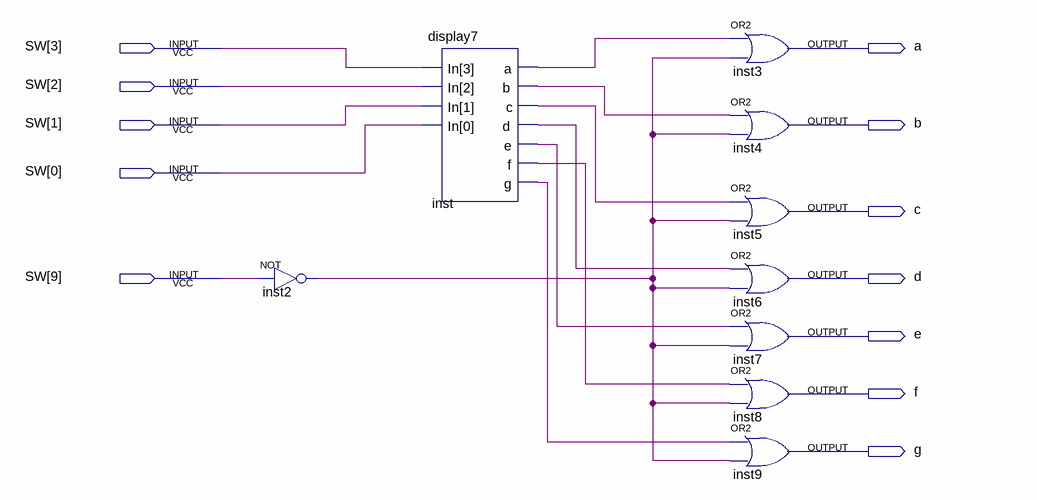
[diagram p0: schematic sheet]
// Quartus schematic display7_en.bdf as structural Verilog: 9 symbols, 12 pins
module display7_en (
  input  [9:0] SW,
  output a,
  output b,
  output c,
  output d,
  output e,
  output f,
  output g
);

  wire inst2_out, inst_a, inst_b, inst_c, inst_d, inst_e, inst_f, inst_g;

  not inst2 (inst2_out, SW[9]);
  display7 inst (.In(SW[3:0]), .a(inst_a), .b(inst_b), .c(inst_c), .d(inst_d), .e(inst_e), .f(inst_f), .g(inst_g));
  or inst3 (a, inst_a, inst2_out);
  or inst4 (b, inst_b, inst2_out);
  or inst5 (c, inst_c, inst2_out);
  or inst6 (d, inst_d, inst2_out);
  or inst7 (e, inst_e, inst2_out);
  or inst8 (f, inst_f, inst2_out);
  or inst9 (g, inst_g, inst2_out);
endmodule
